# EAGLE schematic DP_chipKIT_Uno32_bysa (EAGLE 5.11)
PROJECT: Digilent chipKIT Uno32 compatible
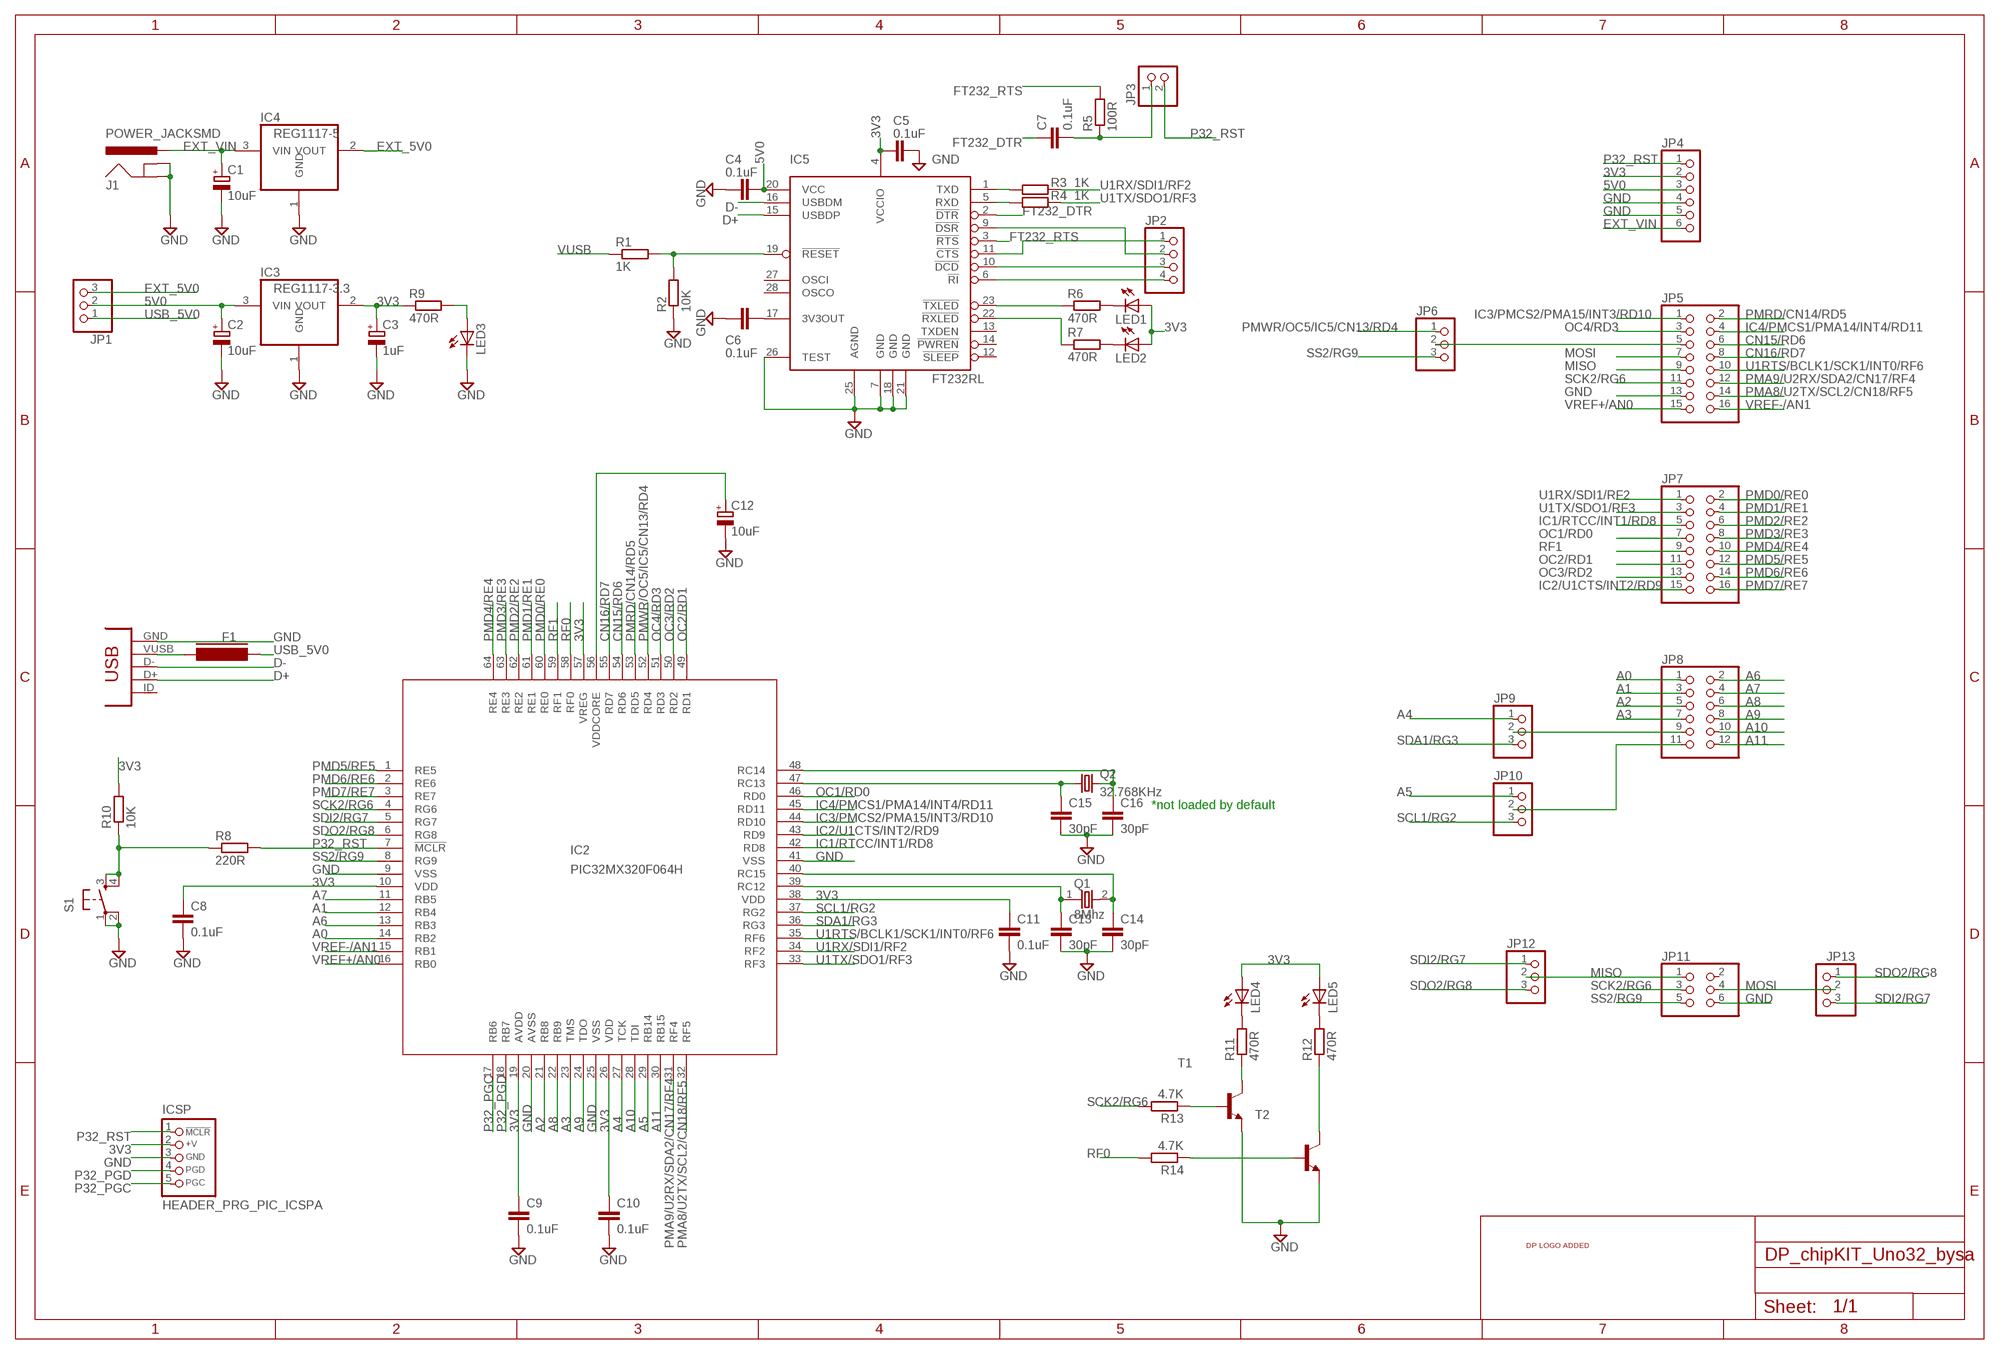
[diagram p0: schematic, sheet 1]

## Parts
C1  10uF  CAP_POLSMC_A  [SMC_A]
C2  10uF  CAP_POLSMC_A  [SMC_A]
C3  1uF  CAP_POLSMC_A  [SMC_A]
C4  0.1uF  CAPC603  [C603]
C5  0.1uF  CAPC603  [C603]
C6  0.1uF  CAPC603  [C603]
C7  0.1uF  CAPC603  [C603]
C8  0.1uF  CAPC603  [C603]
C9  0.1uF  CAPC603  [C603]
C10  0.1uF  CAPC603  [C603]
C11  0.1uF  CAPC603  [C603]
C12  10uF  CAP_POLSMC_A  [SMC_A]
C13  30pF  CAPC603  [C603]
C14  30pF  CAPC603  [C603]
C15  30pF  CAPC603  [C603]
C16  30pF  CAPC603  [C603]
F1  FERRITE_BEAD603  [FB603]
IC2  PIC32MX320F064H  [TQFP64-10X10]
IC3  REG1117-3.3  REG1117  [SOT223]
IC4  REG1117-5  REG1117  [SOT223]
IC5  FT232RL  [SSOP28]
ICSP  HEADER_PRG_PIC_ICSPA  [HEADER_PRG_1X05]
J1  POWER_JACKSMD  [POWER_JACK_SMD]
JP1  PINHD-1X3  [1X03]
JP2  PINHD-1X4  [1X04]
JP3  PINHD-1X2  [1X02]
JP4  PINHD-1X6  [1X06]
JP5  PINHD-2X8  [2X08]
JP6  PINHD-1X3  [1X03]
JP7  PINHD-2X8  [2X08]
JP8  PINHD-2X6  [2X06]
JP9  PINHD-1X3  [1X03]
JP10  PINHD-1X3  [1X03]
JP11  PINHD-2X3  [2X03]
JP12  PINHD-1X3  [1X03]
JP13  PINHD-1X3  [1X03]
LED1  LED805  [LED-805]
LED2  LED805  [LED-805]
LED3  LED805  [LED-805]
LED4  LED805  [LED-805]
LED5  LED805  [LED-805]
Q1  8Mhz  OSC-XTAL  [HC-49U]
Q2  32.768KHz  CRYSTALTC26V  [TC26V]
R1  1K  RESISTORR603  [R603]
R2  10K  RESISTORR603  [R603]
R3  1K  RESISTORR603  [R603]
R4  1K  RESISTORR603  [R603]
R5  100R  RESISTORR603  [R603]
R6  470R  RESISTORR603  [R603]
R7  470R  RESISTORR603  [R603]
R8  220R  RESISTORR603  [R603]
R9  470R  RESISTORR603  [R603]
R10  10K  RESISTORR603  [R603]
R11  470R  RESISTORR603  [R603]
R12  470R  RESISTORR603  [R603]
R13  4.7K  RESISTORR603  [R603]
R14  4.7K  RESISTORR603  [R603]
S1  SW-SMD-SMALL  [TACT_SWITCH_SMALL]
T1  BJT-NPNSOT23BEC  [SOT23-BEC]
T2  BJT-NPNSOT23BEC  [SOT23-BEC]
U$1  DP_LOGO  [DP_LOGO]
USB1  CON-USB-MINI-BUSB1  [CONN_USB_MINI-B]

## Nets
3V3: C3.+ C5.1 C8.1 C9.1 C10.1 C11.1 IC2.10(VDD) IC2.19(AVDD) IC2.26(VDD) IC2.38(VDD) IC2.57(VREG) IC3.2(VOUT) IC5.4(VCCIO) ICSP.2(+V) JP4.2 LED1.A LED2.A LED4.A LED5.A R9.1 R10.2
5V0: C2.+ C4.1 IC3.3(VIN) IC5.20(VCC) JP1.2 JP4.3
A0: IC2.14(RB2) JP8.1
A1: IC2.12(RB4) JP8.3
A2: IC2.21(RB8) JP8.5
A3: IC2.23(TMS) JP8.7
A4: IC2.27(TCK) JP9.1
A5: IC2.29(RB14) JP10.1
A6: IC2.13(RB3) JP8.2
A7: IC2.11(RB5) JP8.4
A8: IC2.22(RB9) JP8.6
A9: IC2.24(TDO) JP8.8
A10: IC2.28(TDI) JP8.10
A11: IC2.30(RB15) JP8.12
CN15/RD6: IC2.54(RD6) JP5.6
CN16/RD7: IC2.55(RD7) JP5.8
CTS: IC5.11(!CTS) JP2.1
D+: IC5.15(USBDP) USB1.D+
D-: IC5.16(USBDM) USB1.D-
DCD: IC5.10(!DCD) JP2.3
DSR: IC5.9(!DSR) JP2.2
EXT_5V0: IC4.2(VOUT) JP1.3
EXT_VIN: C1.+ IC4.3(VIN) J1.VIN0(PWR) JP4.6
FT232_DTR: C7.1 IC5.2(!DTR)
FT232_RTS: IC5.3(!RTS) R5.2
GND: C1.- C2.- C3.- C4.2 C5.2 C6.2 C8.2 C9.2 C10.2 C11.2 C12.- C13.2 C14.2 C15.2 C16.2 IC2.9(VSS) IC2.20(AVSS) IC2.25(VSS) IC2.41(VSS) IC3.1(GND) IC4.1(GND) IC5.7(GND) IC5.18(GND) IC5.21(GND) IC5.25(AGND) IC5.26(TEST) ICSP.3(GND) J1.GND(GNDBREAK) J1.P$4(GND) JP4.4 JP4.5 JP5.13 JP11.6 LED3.C R2.1 S1.1 S1.2 T1.E T2.E USB1.GND
IC1/RTCC/INT1/RD8: IC2.42(RD8) JP7.5
IC2/U1CTS/INT2/RD9: IC2.43(RD9) JP7.15
IC3/PMCS2/PMA15/INT3/RD10: IC2.44(RD10) JP5.1
IC4/PMCS1/PMA14/INT4/RD11: IC2.45(RD11) JP5.4
MISO: JP5.9 JP11.1 JP12.2
MOSI: JP5.7 JP11.4 JP13.2
N$1: C6.1 IC5.17(3V3OUT)
N$2: IC5.19(!RESET) R1.2 R2.2
N$3: IC5.1(TXD) R3.1
N$4: IC5.5(RXD) R4.1
N$5: C12.+ IC2.56(VDDCORE)
N$6: LED1.C R6.2
N$7: C7.2 JP3.1 R5.1
N$8: JP5.5 JP6.2
N$9: JP8.9 JP9.2
N$10: JP8.11 JP10.2
N$11: LED2.C R7.2
N$12: IC5.23(!TXLED) R6.1
N$15: LED3.A R9.2
N$16: R8.1 R10.1 S1.3 S1.4
N$17: R11.1 T1.C
N$18: LED4.C R11.2
N$19: C13.1 IC2.39(RC12) Q1.1
N$20: C14.1 IC2.40(RC15) Q1.2
N$21: LED5.C R12.2
N$22: C15.1 IC2.47(RC13) Q2.1
N$23: C16.1 IC2.48(RC14) Q2.2
N$24: R12.1 T2.C
N$26: R13.1 T1.B
N$27: R14.1 T2.B
N$32: IC5.22(!RXLED) R7.1
OC1/RD0: IC2.46(RD0) JP7.7
OC2/RD1: IC2.49(RD1) JP7.11
OC3/RD2: IC2.50(RD2) JP7.13
OC4/RD3: IC2.51(RD3) JP5.3
P32_PGC: IC2.17(RB6) ICSP.5(PGC)
P32_PGD: IC2.18(RB7) ICSP.4(PGD)
P32_RST: IC2.7(!MCLR) ICSP.1(/MCLR) JP3.2 JP4.1 R8.2
PMA8/U2TX/SCL2/CN18/RF5: IC2.32(RF5) JP5.14
PMA9/U2RX/SDA2/CN17/RF4: IC2.31(RF4) JP5.12
PMD0/RE0: IC2.60(RE0) JP7.2
PMD1/RE1: IC2.61(RE1) JP7.4
PMD2/RE2: IC2.62(RE2) JP7.6
PMD3/RE3: IC2.63(RE3) JP7.8
PMD4/RE4: IC2.64(RE4) JP7.10
PMD5/RE5: IC2.1(RE5) JP7.12
PMD6/RE6: IC2.2(RE6) JP7.14
PMD7/RE7: IC2.3(RE7) JP7.16
PMRD/CN14/RD5: IC2.53(RD5) JP5.2
PMWR/OC5/IC5/CN13/RD4: IC2.52(RD4) JP6.1
RF0: IC2.58(RF0) R14.2
RF1: IC2.59(RF1) JP7.9
RI: IC5.6(!RI) JP2.4
SCK2/RG6: IC2.4(RG6) JP5.11 JP11.3 R13.2
SCL1/RG2: IC2.37(RG2) JP10.3
SDA1/RG3: IC2.36(RG3) JP9.3
SDI2/RG7: IC2.5(RG7) JP12.1 JP13.3
SDO2/RG8: IC2.6(RG8) JP12.3 JP13.1
SS2/RG9: IC2.8(RG9) JP6.3 JP11.5
U1RTS/BCLK1/SCK1/INT0/RF6: IC2.35(RF6) JP5.10
U1RX/SDI1/RF2: IC2.34(RF2) JP7.1 R3.2
U1TX/SDO1/RF3: IC2.33(RF3) JP7.3 R4.2
USB_5V0: F1.1 JP1.1
VREF+/AN0: IC2.16(RB0) JP5.15
VREF-/AN1: IC2.15(RB1) JP5.16
VUSB: F1.2 R1.1 USB1.VUSB
Unconnected: IC5.12(!SLEEP) IC5.13(TXDEN) IC5.14(!PWREN) IC5.27(OSCI) IC5.28(OSCO) JP11.2 USB1.BODY@1(BODY) USB1.BODY@2(BODY) USB1.BODY@3(BODY) USB1.BODY@4(BODY) USB1.ID(USBID)

## Notes on the sheet
- *not loaded by default

## Library data of the parts
C1-C3 C12 = dp_devices:CAP_POL
C4-C11 C13-C16 = dp_devices:CAP
F1 = dp_devices:FERRITE_BEAD
IC2 = microchip:PIC32MX320F*H: PIC32MX320FxxxH Source: http://ww1.microchip.com/downloads/en/DeviceDoc/61143E.pdf, PIC32MX320F064H.bsdl; MPN: PIC32MX320F064H-80I/PT; OC_FARNELL: 1778934; OC_NEWARK: 77M3147
IC3 IC4 = burr-brown:REG1117: 800mA and 1A Low Dropout (LDO) Positive Regulator 1.8V, 2.5V, 2.85V, 3.3V, 5V, and Adj; MPN: REG1117; OC_FARNELL: 1097566; OC_NEWARK: 14P6981
IC5 = dp_devices:FT232RL: USB to serial UART interface
ICSP = dp_devices:HEADER_PRG_PIC_ICSP: 5-pin PIC In Circuit Serial Programming header
J1 = SparkFun:POWER_JACK: Power Jack This is the standard 5.5mm barrel jack for power. The PTH is the most common, proven, reliable, footprint. All others are experimental. The Slot footprint only works if the mill layer is transmitted to the PCB fab house so be warned. Spark Fun Electronics SKU : PRT-00119. Mating wall wart : TOL-00298 (and others)
JP1 JP6 JP9 JP10 JP12 JP13 = pinhead:PINHD-1X3: PIN HEADER
JP2 = pinhead:PINHD-1X4: PIN HEADER
JP3 = pinhead:PINHD-1X2: PIN HEADER
JP4 = pinhead:PINHD-1X6: PIN HEADER
JP5 JP7 = pinhead:PINHD-2X8: PIN HEADER
JP8 = pinhead:PINHD-2X6: PIN HEADER
JP11 = pinhead:PINHD-2X3: PIN HEADER
LED1-LED5 = dp_devices:LED
Q1 = dp_devices:OSC-XTAL
Q2 = crystal:CRYSTAL: CRYSTAL; OC_FARNELL: unknown; OC_NEWARK: unknown
R1-R14 = dp_devices:RESISTOR
S1 = dp_devices:SW-SMD-SMALL
T1 T2 = dp_devices:BJT-NPN: Most commonly used is SOT23-BEC
U$1 = dp_devices:DP_LOGO; FF1: fullfillment by; FF2: Seeed studio; FF3: www.seeedstudio.com; LICENSE: CC-BY-SA; PROJECT: project; URL1: http://; URL2: DangerousPrototypes.com
USB1 = dp_devices:CON-USB-MINI-B: USB connector